# Altium schematic sheet CH340T9R-R0.SchDoc
size 165 x 165 mm; SheetNumber: 0; SheetTotal: 0
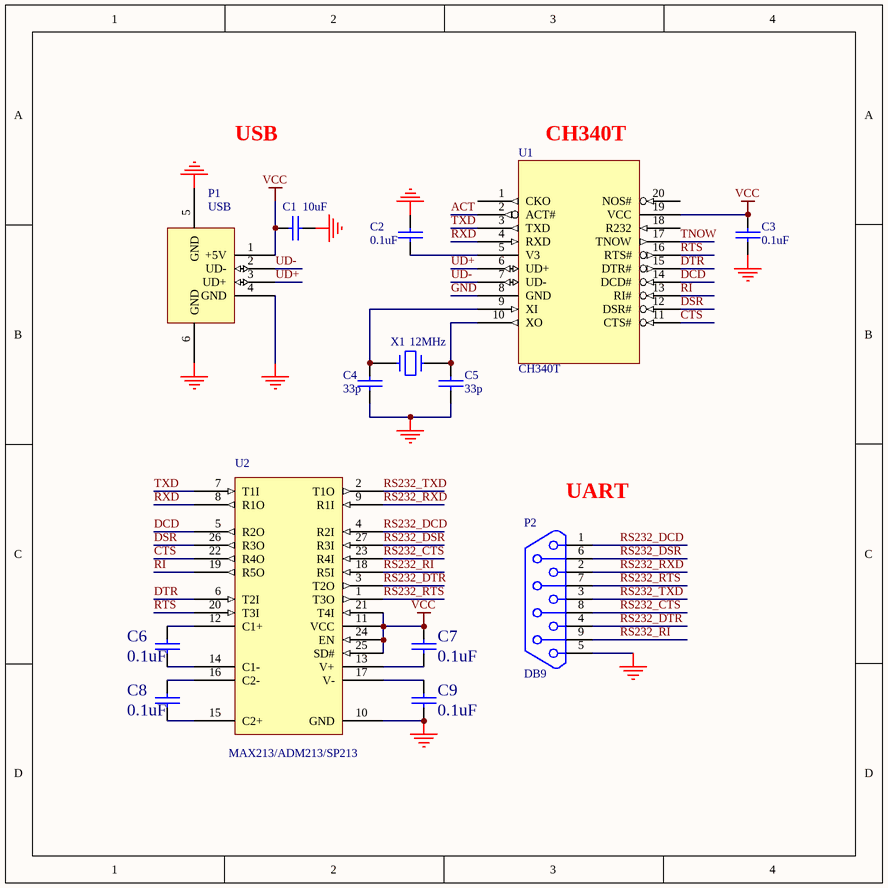
[diagram p0: CH340T9R-R0.SchDoc]

## Parts
C1  10uF  [3216_C]
C2  0.1uF  [0603_C]
C3  0.1uF  [0603_C]
C4  33p  [0603_C]
C5  33p  [0603_C]
C6  0.1uF  [0603_C]
C7  0.1uF  [0603_C]
C8  0.1uF  [0603_C]
C9  0.1uF  [0603_C]
P1  USB  [USBAM]
P2  DB9  [DB9-PAD-M]
U1  CH340T  [SSOP20]
U2  MAX213/ADM213/SP213  [SSOP28]
X1  12MHz  [XT3225]

## Nets
GND: C1.2 C2.2 C3.2 C4.2 C5.2 C9.2 P1.4(GND) P1.5(GND) P1.6(GND) P2.5 U1.8(GND) U2.10(GND)
VCC: C1.1 C3.1 C7.1 P1.1(+5V) U1.19(VCC) U2.11(VCC) U2.21(T4I) U2.24(EN) U2.25(SD#)
ACT: U1.2(ACT#)
CTS: U1.11(CTS#) U2.22(R4O)
DCD: U1.14(DCD#) U2.5(R2O)
DSR: U1.12(DSR#) U2.26(R3O)
DTR: U1.15(DTR#) U2.6(T2I)
RI: U1.13(RI#) U2.19(R5O)
RS232_CTS: P2.8 U2.23(R4I)
RS232_DCD: P2.1 U2.4(R2I)
RS232_DSR: P2.6 U2.27(R3I)
RS232_DTR: P2.4 U2.3(T2O)
RS232_RI: P2.9 U2.18(R5I)
RS232_RTS: P2.7 U2.1(T3O)
RS232_RXD: P2.2 U2.9(R1I)
RS232_TXD: P2.3 U2.2(T1O)
RTS: U1.16(RTS#) U2.20(T3I)
RXD: U1.4(RXD) U2.8(R1O)
TNOW: U1.17(TNOW)
TXD: U1.3(TXD) U2.7(T1I)
UD+: P1.3(UD+) U1.6(UD+)
UD-: P1.2(UD-) U1.7(UD-)
NetC2_1: C2.1 U1.5(V3)
NetC4_1: C4.1 U1.9(XI) X1.1
NetC5_1: C5.1 U1.10(XO) X1.3
NetC6_1: C6.1 U2.12(C1+)
NetC6_2: C6.2 U2.14(C1-)
NetC7_2: C7.2 U2.13(V+)
NetC8_1: C8.1 U2.16(C2-)
NetC8_2: C8.2 U2.15(C2+)
NetC9_1: C9.1 U2.17(V-)

Not connected (* = marked no-connect by the designer): U1 1(CKO) 18(R232) 20(NOS#)

## Notes on the sheet
- USB
- CH340T
- (near P2) UART

## Library data of the parts
C1-C9 = CAP: Capacitor
U1 = CH340T: USB to TTL Serial / UART,  USB to IrDA
U2 = MAX213
X1 = CRYSTAL